# EAGLE design 7seg_pcb (EAGLE 9.3.2)
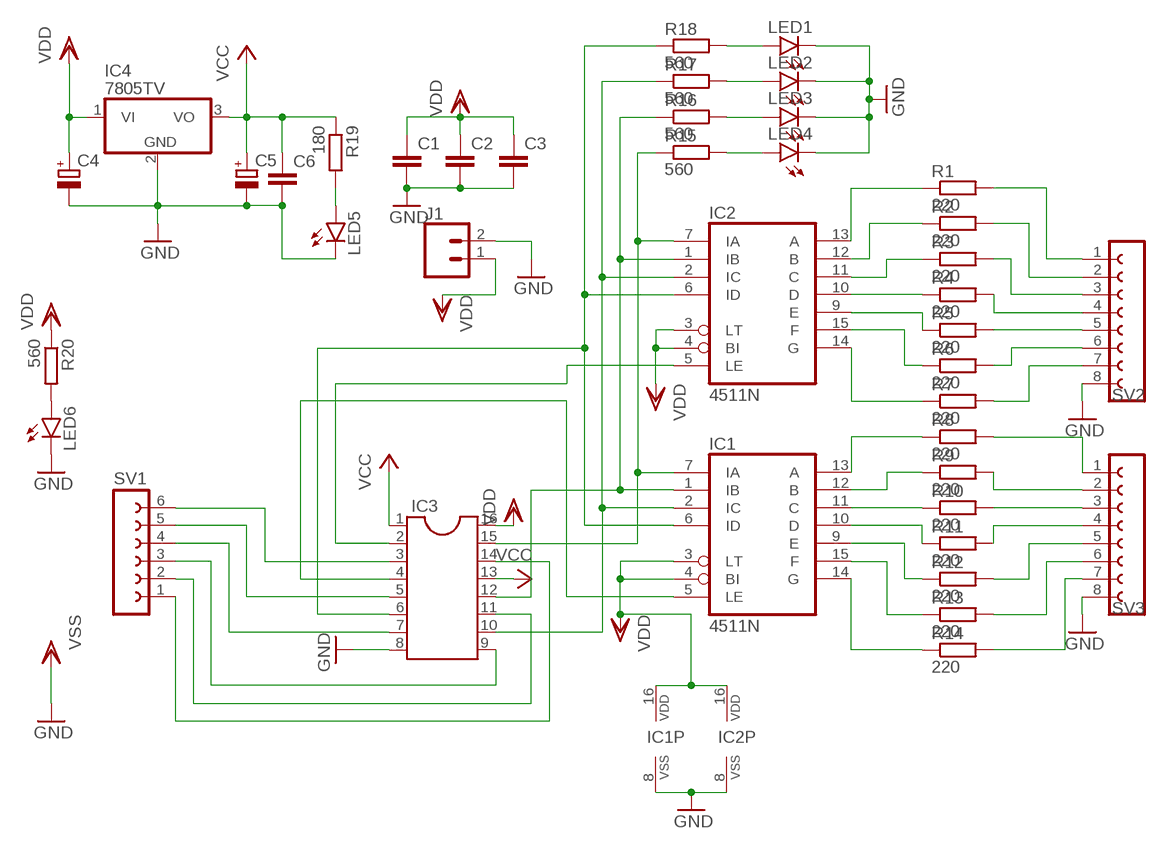
[diagram p0: schematic, sheet 1]

## Parts
C1  C-EUC0805K  [C0805K]
C2  C-EUC0805K  [C0805K]
C3  C-EUC0805K  [C0805K]
C4  CPOL-EUD  [PANASONIC_D]
C5  CPOL-EUD  [PANASONIC_D]
C6  C-EUC0805K  [C0805K]
IC1  4511N  [DIL16]
IC2  4511N  [DIL16]
IC3  DIL16S  [SOCKET-16]
IC4  7805TV  [TO220V]
J1  CONN_025MM  [SCREWTERMINAL-5MM-2]
LED1  LEDCHIPLED_0805  [CHIPLED_0805]
LED2  LEDCHIPLED_0805  [CHIPLED_0805]
LED3  LEDCHIPLED_0805  [CHIPLED_0805]
LED4  LEDCHIPLED_0805  [CHIPLED_0805]
LED5  LEDCHIPLED_0805  [CHIPLED_0805]
LED6  LEDCHIPLED_0805  [CHIPLED_0805]
R1  220  R-EU_R0805  [R0805]
R2  220  R-EU_R0805  [R0805]
R3  220  R-EU_R0805  [R0805]
R4  220  R-EU_R0805  [R0805]
R5  220  R-EU_R0805  [R0805]
R6  220  R-EU_R0805  [R0805]
R7  220  R-EU_R0805  [R0805]
R8  220  R-EU_R0805  [R0805]
R9  220  R-EU_R0805  [R0805]
R10  220  R-EU_R0805  [R0805]
R11  220  R-EU_R0805  [R0805]
R12  220  R-EU_R0805  [R0805]
R13  220  R-EU_R0805  [R0805]
R14  220  R-EU_R0805  [R0805]
R15  560  R-EU_R0805  [R0805]
R16  560  R-EU_R0805  [R0805]
R17  560  R-EU_R0805  [R0805]
R18  560  R-EU_R0805  [R0805]
R19  180  R-EU_R0805  [R0805]
R20  560  R-EU_R0805  [R0805]
SV1  FE06-1  [FE06]
SV2  FE08-1  [FE08]
SV3  FE08-1  [FE08]

## Nets
GND: C1.2 C2.2 C3.2 C4.- C5.- C6.2 IC1.8(VSS) IC2.8(VSS) IC3.8 IC4.2(GND) J1.2 LED1.C LED2.C LED3.C LED4.C LED5.C LED6.C SV2.8 SV3.8 ; supply symbol labelled VSS
N$1: IC2.13(A) R1.1
N$2: IC2.12(B) R2.1
N$3: IC2.11(C) R3.1
N$4: IC2.10(D) R4.1
N$5: R14.2 SV3.7
N$6: R13.2 SV3.6
N$7: R12.2 SV3.5
N$8: R11.2 SV3.4
N$9: R10.2 SV3.3
N$10: R9.2 SV3.2
N$11: R8.2 SV3.1
N$12: R7.2 SV2.7
N$13: R6.2 SV2.6
N$14: R5.2 SV2.5
N$15: R4.2 SV2.4
N$16: R3.2 SV2.3
N$17: R2.2 SV2.2
N$18: R1.2 SV2.1
N$19: IC2.9(E) R5.1
N$20: IC2.15(F) R6.1
N$21: IC2.14(G) R7.1
N$22: IC1.13(A) R8.1
N$23: IC1.12(B) R9.1
N$24: IC1.11(C) R10.1
N$25: IC1.10(D) R11.1
N$26: IC1.9(E) R12.1
N$27: IC1.15(F) R13.1
N$28: IC1.14(G) R14.1
N$29: IC1.7(IA) IC2.7(IA) IC3.15 R15.1
N$30: LED1.A R18.2
N$31: IC1.1(IB) IC2.1(IB) IC3.12 R16.1
N$32: LED2.A R17.2
N$33: IC1.2(IC) IC2.2(IC) IC3.10 R17.1
N$34: IC1.6(ID) IC2.6(ID) IC3.6 R18.1
N$35: IC1.5(LE) IC3.4
N$36: IC3.3 SV1.6
N$37: LED3.A R16.2
N$38: LED4.A R15.2
N$39: IC3.14 SV1.1
N$40: IC3.11 SV1.2
N$41: IC3.9 SV1.3
N$42: IC3.7 SV1.4
N$43: IC3.5 SV1.5
N$44: LED5.A R19.2
N$45: IC2.5(LE) IC3.2
N$46: LED6.A R20.2
VCC: C5.+ C6.1 IC3.1 IC3.13 IC4.3(VO) R19.1
VDD: C1.1 C2.1 C3.1 C4.+ IC1.3(LT) IC1.4(BI) IC1.16(VDD) IC2.3(LT) IC2.4(BI) IC2.16(VDD) IC3.16 IC4.1(VI) J1.1 R20.1

## Library data of the parts
C1-C3 C6 = rcl:C-EU: CAPACITOR, European symbol; SPICEPREFIX: C
C4 C5 = rcl:CPOL-EU: POLARIZED CAPACITOR, European symbol; SPICEPREFIX: C
IC1 IC2 = 45xx:4511: BCD to 7-segment LATCH/DECODER/DRIVER
IC3 = ic-package:DIL16: Dual In Line / Socket
IC4 = linear:78*: Positive VOLTAGE REGULATOR Source: http://cache.national.com/ds/LM/LM78L05.pdf http://www.fairchildsemi.com/ds/LM/LM7805.pdf
J1 = SparkFun-Connectors:CONN_02: Multi connection point. Often used as Generic Header-pin footprint for 0.1 inch spaced/style header connections On any of the 0.1 inch spaced packages, you can populate with these: Break Away Headers - Straight <https://www.sparkfun.com/products/116> (PRT-00116) Break Away Male Headers - Right Angle <https://www.sparkfun.com/products/553> (PRT-00553) Female Headers <https://www.sparkfun.com/products/115> (PRT-00115) Break Away Headers - Machine Pin <https://www.sparkfun.com/products/117> (PRT-00117) Break Away Female Headers - Swiss Machine Pin <https://www.sparkfun.com/products/743> (PRT-00743) For SCREWTERMINALS and SPRING TERMINALS visit here: Screw Terimnals on SparkFun.com <https://www.sparkfun.com/search/results?term=Screw+Terminals> (5mm/3.5mm/2.54mm spacing) This device is also useful as a general connection point to wire up your design to another part of your project. Our various solder wires solder well into these plated through hole pads. Hook-Up Wire - Assortment (Stranded, 22 AWG) <https://www.sparkfun.com/products/11375> (PRT-11375) Hook-Up Wire - Assortment (Solid Core, 22 AWG) <https://www.sparkfun.com/products/11367> (PRT-11367) View the entire wire category on our website here <https://www.sparkfun.com/categories/141> Special notes: Molex polarized connector foot print use with: PRT-08233 with associated crimp pins and housings. 2.54_SCREWTERM for use with PRT-10571. 3.5mm Screw Terminal footprints for PRT-08084 5mm Screw Terminal footprints for use with PRT-08432; SF_SKU: PRT-08432
LED1-LED6 = led:LED: LED OSRAM: - CHIPLED LG R971, LG N971, LY N971, LG Q971, LY Q971, LO R971, LY R971 LH N974, LH R974 LS Q976, LO Q976, LY Q976 LO Q996 - Hyper CHIPLED LW Q18S LB Q993, LB Q99A, LB R99A - SideLED LS A670, LO A670, LY A670, LG A670, LP A670 LB A673, LV A673, LT A673, LW A673 LH A674 LY A675 LS A676, LA A676, LO A676, LY A676, LW A676 LS A679, LY A679, LG A679 - Hyper Micro SIDELED® LS Y876, LA Y876, LO Y876, LY Y876 LT Y87S - SmartLED LW L88C, LW L88S LB L89C, LB L89S, LG L890 LS L89K, LO L89K, LY L89K LS L896, LA L896, LO L896, LY L896 - TOPLED LS T670, LO T670, LY T670, LG T670, LP T670 LSG T670, LSP T670, LSY T670, LOP T670, LYG T670 LG T671, LOG T671, LSG T671 LB T673, LV T673, LT T673, LW T673 LH T674 LS T676, LA T676, LO T676, LY T676, LB T676, LH T676, LSB T676, LW T676 LB T67C, LV T67C, LT T67C, LS T67K, LO T67K, LY T67K, LW E67C LS E67B, LA E67B, LO E67B, LY E67B, LB E67C, LV E67C, LT E67C LW T67C LS T679, LY T679, LG T679 LS T770, LO T770, LY T770, LG T770, LP T770 LB T773, LV T773, LT T773, LW T773 LH T774 LS E675, LA E675, LY E675, LS T675 LS T776, LA T776, LO T776, LY T776, LB T776 LHGB T686 LT T68C, LB T68C - Hyper Mini TOPLED® LB M676 - Mini TOPLED Santana® LG M470 LS M47K, LO M47K, LY M47K Source: http://www.osram.convergy.de LUXEON: - LUMILED® LXK2-PW12-R00, LXK2-PW12-S00, LXK2-PW14-U00, LXK2-PW14-V00 LXK2-PM12-R00, LXK2-PM12-S00, LXK2-PM14-U00 LXK2-PE12-Q00, LXK2-PE12-R00, LXK2-PE12-S00, LXK2-PE14-T00, LXK2-PE14-U00 LXK2-PB12-K00, LXK2-PB12-L00, LXK2-PB12-M00, LXK2-PB14-N00, LXK2-PB14-P00, LXK2-PB14-Q00 LXK2-PR12-L00, LXK2-PR12-M00, LXK2-PR14-Q00, LXK2-PR14-R00 LXK2-PD12-Q00, LXK2-PD12-R00, LXK2-PD12-S00 LXK2-PH12-R00, LXK2-PH12-S00 LXK2-PL12-P00, LXK2-PL12-Q00, LXK2-PL12-R00 Source: www.luxeon.com KINGBRIGHT: KA-3528ASYC Source: www.kingbright.com
R1-R20 = resistor:R-EU_: RESISTOR, European symbol
SV1 = con-lsta:FE06-1: FEMALE HEADER; OC_FARNELL: unknown; OC_NEWARK: unknown
SV2 SV3 = con-lsta:FE08-1: FEMALE HEADER; OC_FARNELL: unknown; OC_NEWARK: unknown

## Board
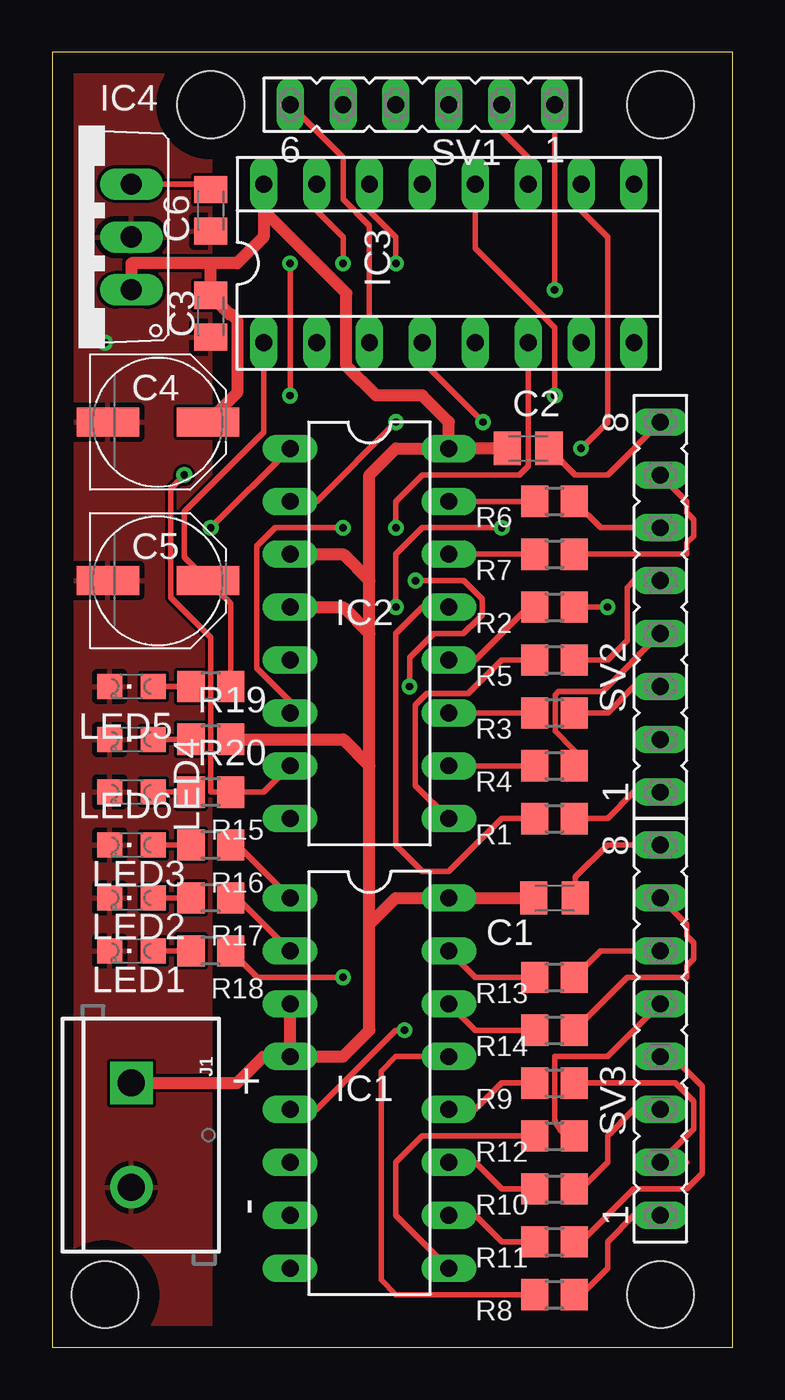
[diagram p1: board, top side]
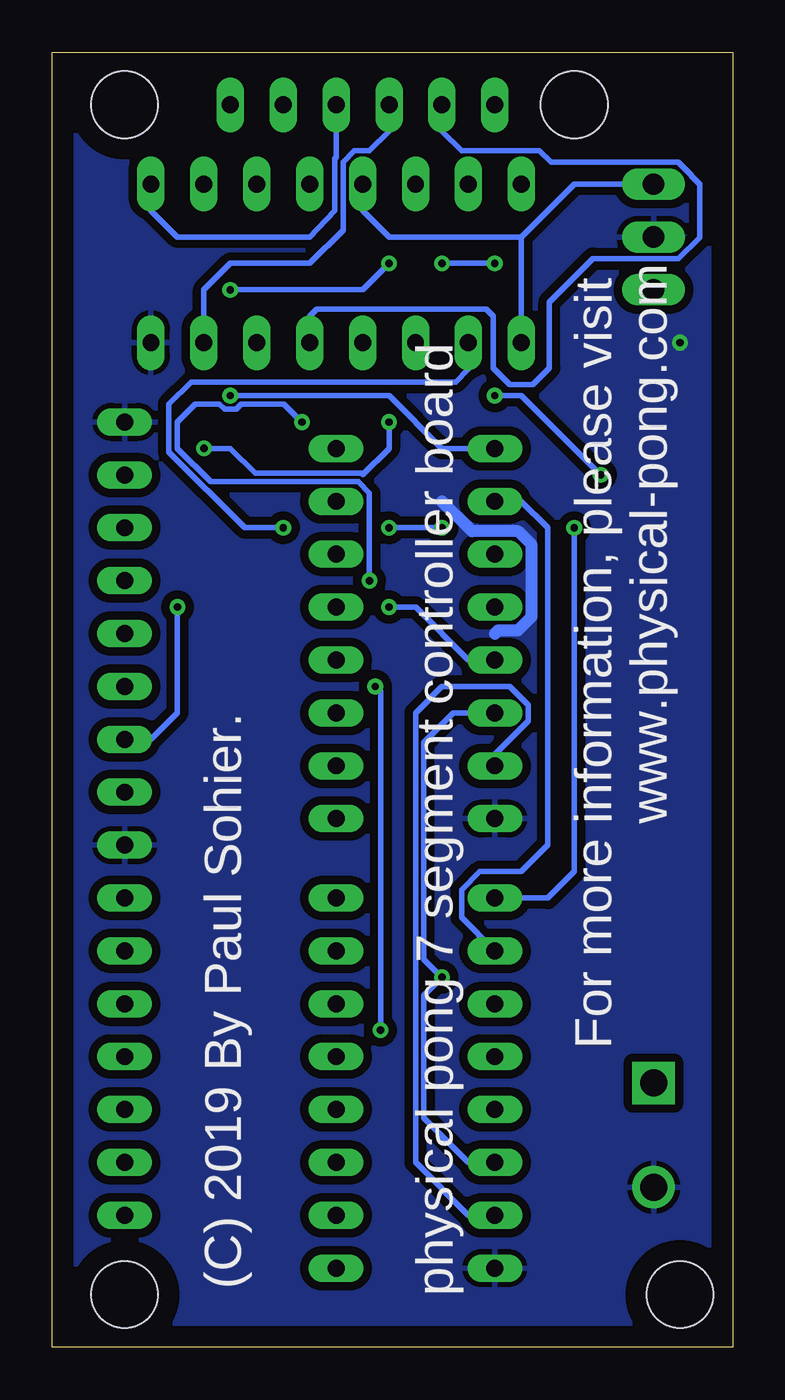
[diagram p2: board, bottom side, seen from below]

Size 32.69 x 62.22 mm. Coordinates in mm from the lower left corner, seen from the top.
Outline: 0,0 32.69,0 32.69,62.22 0,62.22 0,0
Copper layers (1*16): Top 0.035mm / dielectric 1.5mm / Bottom 0.035mm
Design rules "default": minimum track width 6mil, minimum drill 0.35mm, track to track 6mil, track to pad 6mil, pad to pad 6mil, via to via 6mil, smd to smd 6mil, copper to edge 40mil, drill to drill 6mil, minimum pad ring 10mil, minimum via ring 8mil, stop-mask expansion 4mil, vias tented up to drill 0mil, thermal gap 10mil
Holes 3.2 mm at 2.54,2.54 29.21,2.54 29.21,59.69 7.62,59.69

### Footprints (pad centres in the part's own frame; a part is rotated, then mirrored left to right if it is on the bottom)
C0805K = smd 1.3 x 1.6: 1 -1,0; 2 1,0
PANASONIC_D = smd 3 x 1.4: + 2.4,0; - -2.4,0
DIL16 = drill 0.813 long: 1 -8.89,-3.81; 2 -6.35,-3.81; 3 -3.81,-3.81; 4 -1.27,-3.81; 5 1.27,-3.81; 6 3.81,-3.81; 7 6.35,-3.81; 8 8.89,-3.81; 9 8.89,3.81; 10 6.35,3.81; 11 3.81,3.81; 12 1.27,3.81; 13 -1.27,3.81; 14 -3.81,3.81; 15 -6.35,3.81; 16 -8.89,3.81
SOCKET-16 = drill 0.813 long: 1 -8.89,-3.81; 2 -6.35,-3.81; 3 -3.81,-3.81; 4 -1.27,-3.81; 5 1.27,-3.81; 6 3.81,-3.81; 7 6.35,-3.81; 8 8.89,-3.81; 9 8.89,3.81; 10 6.35,3.81; 11 3.81,3.81; 12 1.27,3.81; 13 -1.27,3.81; 14 -3.81,3.81; 15 -6.35,3.81; 16 -8.89,3.81
TO220V = drill 1.016 long: 1 -2.54,-2.54; 2 0,-2.54; 3 2.54,-2.54
SCREWTERMINAL-5MM-2 = drill 1.3 pad 2.032 square: 1 0,0 | drill 1.3 pad 2.032: 2 5,0
CHIPLED_0805 = smd 1.2 x 1.2: A 0,-1.05; C 0,1.05
R0805 = smd 1.3 x 1.5: 1 -0.95,0; 2 0.95,0
FE06 = drill 0.813 long: 1 -6.35,0; 2 -3.81,0; 3 -1.27,0; 4 1.27,0; 5 3.81,0; 6 6.35,0
FE08 = drill 0.813 long: 1 -8.89,0; 2 -6.35,0; 3 -3.81,0; 4 -1.27,0; 5 1.27,0; 6 3.81,0; 7 6.35,0; 8 8.89,0

### Placement (x,y rotation side)
C1  24.13,21.59 0 top
C2  22.86,43.18 0 top
C3  7.62,49.53 270 top
C4  5.08,44.45 0 top
C5  5.08,36.83 0 top
C6  7.62,54.61 270 top
IC1  15.24,12.7 270 top
IC2  15.24,34.29 270 top
IC3  19.05,52.07 0 top
IC4  1.27,53.34 90 top
J1  3.81,12.7 270 top
LED1  3.81,19.05 90 top
LED2  3.81,21.59 90 top
LED3  3.81,24.13 90 top
LED4  3.81,26.67 90 top
LED5  3.81,31.75 90 top
LED6  3.81,29.21 90 top
R1  24.13,25.4 0 top
R2  24.13,35.56 0 top
R3  24.13,30.48 0 top
R4  24.13,27.94 0 top
R5  24.13,33.02 0 top
R6  24.13,40.64 0 top
R7  24.13,38.1 0 top
R8  24.13,2.54 0 top
R9  24.13,12.7 0 top
R10  24.13,7.62 0 top
R11  24.13,5.08 0 top
R12  24.13,10.16 0 top
R13  24.13,17.78 0 top
R14  24.13,15.24 0 top
R15  7.62,26.67 180 top
R16  7.62,24.13 180 top
R17  7.62,21.59 180 top
R18  7.62,19.05 180 top
R19  7.62,31.75 180 top
R20  7.62,29.21 180 top
SV1  17.78,59.69 180 top
SV2  29.21,35.56 90 top
SV3  29.21,15.24 90 top

### Tracks (layer width: path | path; a pad name or v marks a point on that pad's centre or on a via)
GND  (via drill 0.35)
  Top 0.254: C1.2 25.13,22.59 26.67,24.13 SV3.8 | C2.2 25.13,41.91 26.67,41.91 SV2.8
  Top 0.584: C3.2 7.35,48.26
  Bottom 0.584: 11.43,34.29 11.27,34.45 10.31,34.45 9.66,35.1 9.66,38.56 10.31,39.2 12.54,39.2 13.97,40.64
  other vias: 2.54,48.26
  pour Bottom (isolate 0.406): 0,0 33.02,0 33.02,62.23 0,62.23
  pour Top: 0,62.23 7.62,62.23 7.62,0 0,0
N$1
  Top 0.254: IC2.13 17.78,35.56 16.51,34.29 16.51,24.13 17.78,22.86 19.05,22.86 21.59,25.4 R1.1
N$2
  Top 0.254: IC2.12 20.32,33.02 22.86,35.56 R2.1
N$3
  Top 0.254: IC2.11 R3.1
N$4
  Top 0.254: IC2.10 R4.1
N$5
  Top 0.254: R14.2 27.62,17.78 30.48,17.78 30.48,18.33 30.81,18.66 30.81,19.44 30.48,19.77 30.48,20.32 SV3.7
N$6
  Top 0.254: SV3.6 26.35,19.05 R13.2
N$7
  Top 0.254: R12.2 arc-90 24.13,11.11 24.13,13.97 26.67,13.97 SV3.5
N$8
  Top 0.254: R11.2 25.4,5.08 27.94,7.62 30.48,7.62 31.22,8.36 31.22,12.54 29.79,13.97 SV3.4
N$9
  Top 0.254: SV3.3 27.94,11.43 26.67,10.16 26.67,8.89 25.4,7.62 R10.2
N$10
  Top 0.254: 25.4,12.7 R9.2 29.93,12.7 30.81,11.82 30.81,10.49 SV3.2 30.48,8.89
N$11
  Top 0.254: R8.2 25.4,2.54 26.67,3.81 26.67,5.08 27.94,6.35 SV3.1
N$12
  Top 0.254: R7.2 30.48,38.1 30.48,38.65 30.81,38.98 30.81,39.76 30.48,40.09 30.48,40.64 SV2.7
N$13
  Top 0.254: R6.2 26.35,39.37 SV2.6
N$14
  Top 0.254: R5.2 26.67,33.02 27.61,33.96 27.61,36.5 27.94,36.83 SV2.5
N$15
  Top 0.254: R4.2 25.08,28.68 24.15,29.61 24.15,31.35 24.31,31.51 26.43,31.51 SV2.4
N$16
  Top 0.254: R3.2 26.67,30.48 27.94,31.75 SV2.3
N$17  (via drill 0.35)
  Top 0.254: R2.2 v26.67,35.56
  Bottom 0.254: v26.67,35.56 26.67,30.48 27.94,29.21 SV2.2
N$18
  Top 0.254: R1.2 26.67,25.4 27.94,26.67 SV2.1
N$19
  Top 0.254: IC2.9 17.45,27 17.45,30.87 18,31.42 19.05,31.42 19.99,31.42 21.59,33.02 R5.1
N$20
  Top 0.254: IC2.15 R6.1
N$21
  Top 0.254: IC2.14 R7.1
N$22
  Top 0.254: IC1.13 16.51,13.97 15.81,13.27 15.81,3.24 16.51,2.54 R8.1
N$23
  Top 0.254: IC1.12 20.32,11.43 21.59,12.7 R9.1
N$24
  Top 0.254: IC1.11 20.32,8.89 21.59,7.62 R10.1
N$25
  Top 0.254: IC1.10 20.32,6.35 21.59,5.08 R11.1
N$26
  Top 0.254: IC1.9 16.51,6.35 16.51,8.89 17.78,10.16 R12.1
N$27
  Top 0.254: R13.1 20.32,17.78 IC1.15
N$28
  Top 0.254: R14.1 20.32,15.24 IC1.14
N$29  (via drill 0.35)
  Top 0.254: IC2.7 10.16,26.67 R15.1 7.62,26.67 7.62,34.09 5.7,36.01 5.7,41.26 v6.35,41.91 | IC3.15 12.7,54.61 13.97,53.34 v13.97,52.07 | v11.43,45.72 v11.43,52.07
  Bottom 0.254: IC1.7 12.7,6.35 15.24,8.89 15.24,30.48 13.97,31.75 10.71,31.75 9.83,30.87 9.83,30.09 11.43,28.49 IC2.7 | v13.97,52.07 v11.43,52.07 | v6.35,41.91 10.16,45.72 v11.43,45.72
N$30
  Top 0.254: R18.2 LED1.A
N$31  (via drill 0.35)
  Top 0.254: IC1.1 8.89,24.13 R16.1 | IC3.12 20.32,52.79 24.13,48.98 v24.13,45.72 | IC2.1 v7.62,39.37
  Bottom 0.254: IC1.1 8.89,21.59 7.62,22.86 v7.62,39.37 | IC2.1 13.97,43.18 16.51,45.72 v24.13,45.72
N$32
  Top 0.254: R17.2 LED2.A
N$33  (via drill 0.35)
  Top 0.254: v16.51,44.45 12.7,40.64 IC2.2 | IC1.2 8.89,21.59 R17.1 | IC3.10 25.4,54.61 26.67,53.34 26.67,44.45 v25.4,43.18
  Bottom 0.254: IC2.2 10.16,40.64 8.89,39.37 8.89,24.13 10.16,22.86 12.15,22.86 13.03,21.98 13.03,20.65 IC1.2 | v25.4,43.18 24.13,43.18 22.94,41.99 17.83,41.99 17.77,41.92 16.51,43.18 v16.51,44.45
N$34  (via drill 0.35)
  Top 0.254: R18.1 9.84,17.78 v13.97,17.78 | IC2.6 11.43,31.03 9.83,32.63 9.83,38.49 10.71,39.37 v13.97,39.37 | v16.51,39.37 16.51,40.64 17.78,41.91 22.43,41.91 22.86,42.34 IC3.6
  Bottom 0.254: IC1.6 12.7,8.89 14.83,11.02 14.83,16.92 v13.97,17.78 14.83,18.64 14.83,29.07 13.42,30.48 IC2.6 | v13.97,39.37 v16.51,39.37
N$35  (via drill 0.35)
  Top 0.254: v20.7,44.45 17.78,47.37 IC3.4 | IC1.5 12.7,11.43 16.51,15.24 v16.92,15.24 | v17.17,31.75 17.17,33.13 18.33,34.29 19.75,34.29 20.07,34.62 20.1,34.62 20.65,35.17 20.65,35.95 19.77,36.83 v17.45,36.83
  Bottom 0.254: v17.45,36.83 17.45,41.03 18,41.58 25.07,41.58 26.67,43.18 26.67,44.45 25.81,45.31 24.65,45.31 24.4,45.06 23.86,45.06 23.61,45.31 21.56,45.31 v20.7,44.45 | v17.17,31.75 16.92,31.5 v16.92,15.24
N$36
  Top 0.254: IC3.3 15.24,53.89 13.97,55.16 13.97,57.15 SV1.6
N$37
  Top 0.254: R16.2 LED3.A
N$38
  Top 0.254: R15.2 LED4.A
N$39  (via drill 0.35)
  Top 0.254: SV1.1 v24.13,50.8 | v16.51,52.07 16.51,53.34 15.24,54.61 IC3.14
  Bottom 0.254: v24.13,50.8 17.78,50.8 v16.51,52.07
N$40
  Top 0.254: SV1.2 21.59,58.42 22.86,57.15 IC3.11
N$41
  Bottom 0.254: SV1.3 19.05,57.17 19.13,57.1 19.13,54.61 20.32,53.34 26.67,53.34 27.94,54.61 IC3.9
N$42
  Bottom 0.254: SV1.4 16.51,58.42 17.45,57.48 18.17,57.48 18.72,56.93 18.72,53.67 20.32,52.07 24.13,52.07 25.4,50.8 IC3.7
N$43
  Bottom 0.254: IC3.5 20.32,49.53 19.99,49.86 11.84,49.86 11.51,49.53 11.51,47.04 10.72,46.25 9.6,46.25 8.81,47.04 8.81,50.21 6.72,52.3 2.62,52.3 1.6,53.31 1.6,55.88 2.01,56.29 2.01,56.31 2.62,56.92 8.73,56.92 9.29,57.48 13.03,57.48 13.97,58.42 SV1.5
N$44
  Top 0.254: R19.2 LED5.A
N$45  (via drill 0.35)
  Top 0.254: v21.59,39.37 17.78,39.37 16.51,38.1 v16.51,35.56
  Bottom 0.254: v16.51,35.56 15.24,35.56 12.7,33.02 IC2.5 | IC3.2 12.7,46.99 13.31,46.38 26.01,46.38 27.08,45.31 27.08,43.01 23.43,39.37 v21.59,39.37
N$46
  Top 0.254: R20.2 LED6.A
VCC
  Top 0.254: R19.1 8.57,35.74 7.55,36.76 C5.+ 6.35,37.96 6.35,40.15 10.16,43.96 IC3.1 | IC4.3 7.35,55.88 C6.1
  Bottom 0.254: 10.16,53.34 IC3.1 | 10.16,53.34 7.62,55.88 IC4.3 | IC3.13 17.78,54.61 16.51,53.34 10.16,53.34
VDD
  Top 0.254: IC1.16 17.78,21.59
  Top 0.584: J1.1 8.89,12.7 10.16,13.97 IC1.4 | IC1.4 13.97,13.97 15.24,15.24 15.24,20.32 | 15.24,20.32 15.24,27.94 | 15.24,27.94 15.24,34.29 | 15.24,34.29 15.24,36.83 | 15.24,36.83 15.24,41.91 16.51,43.18 IC2.16 | 7.62,44.59 C4.+ 8.89,45.86 8.89,49.34 8.6,49.62 8.53,49.62 C3.1 | IC2.4 13.97,35.56 15.24,34.29 | IC2.3 13.97,38.1 15.24,36.83 | R20.1 13.97,29.21 15.24,27.94 | 15.24,20.32 16.51,21.59 IC1.16 C1.1 | IC1.4 IC1.3 | IC4.1 3.81,52.07 7.62,52.07 | C3.1 7.62,50.83 | C2.1 IC2.16 | IC2.16 19.05,44.45 17.78,45.72 15.56,45.72 14.13,47.14 14.13,50.63 10.16,54.61 IC3.16 10.16,53.34 8.89,52.07 7.62,52.07 | C3.1 7.62,52.07

### Text on the board
tPlace: - +
bPlace: For more information, please visit / www.physical-pong.com | physical pong 7 segment controller board | (C) 2019 By Paul Sohier.